# Altium schematic sheet power.SchDoc
size A4
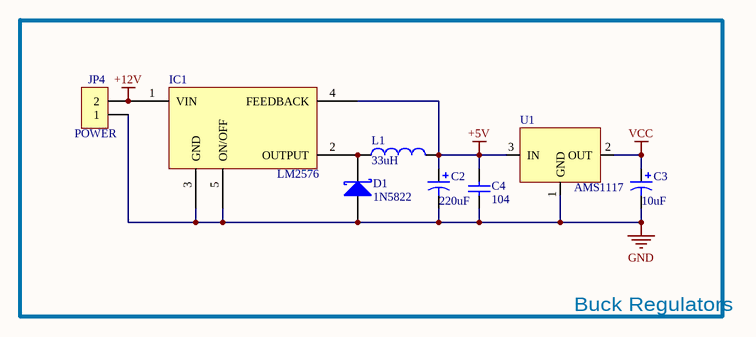
[diagram p0: power.SchDoc]

## Parts
C2  220uF  [CM E(8*10.2)]
C3  10uF  [CD A(3216)]
C4  104  [C 0603_L]
D1  1N5822  [DO_201_AD]
IC1  LM2576  [TO263-5A]
JP4  POWER  [KF128-5.08-2P]
L1  33uH  [CDRH127]
U1  AMS1117  [SOT_223]

## Blocks framed on the sheet
Buck Regulators: C2-C4 D1 IC1 JP4 L1 U1

## Nets
+5V: C2.1 C4.2 IC1.4(FEEDBACK) L1.2 U1.3(IN)
+12V: IC1.1(VIN) JP4.2
GND: C2.2 C3.2 C4.1 D1.1(A) IC1.3(GND) IC1.5(ON/OFF) JP4.1 U1.1(GND)
VCC: C3.1 U1.2(OUT)
NetD1_2: D1.2(K) IC1.2(OUTPUT) L1.1

## Library data of the parts
C2 C3 = Cap Pol1: Polarized Capacitor (Radial); Published: 8-Jun-2000; LatestRevisionDate: 17-Jul-2002; LatestRevisionNote: Re-released for DXP Platform.; PackageReference: RB7.6-15; Publisher: Altium Limited; PackageDescription: Polarized Capacitor (Radial); 2 Leads
  C2: Value: 220uF
  C3: Value: 10uF
C4 = Cap: Capacitor; Published: 8-Jun-2000; LatestRevisionDate: 17-Jul-2002; LatestRevisionNote: Re-released for DXP Platform.; PackageReference: RAD-0.3; Publisher: Altium Limited; PackageDescription: Radial Cap, Thru-Hole; 2 Leads; 0.3 in Pin Spacing; Value: 104
D1 = Diode 11DQ03: Schottky Rectifier; Published: 8-Jun-2000; LatestRevisionDate: 17-Jul-2002; LatestRevisionNote: Re-released for DXP Platform.; DatasheetVersion: Dec-1997; PackageReference: DO-204AL; Publisher: Altium Limited; PackageDescription: Diode, Axial; Body 5.2 x 2.7 mm (LxDia. max), Lead Dia. 0.86 mm (max); Code_JEDEC: DO-204-AL; ComponentLink1Description: Manufacturer Link; ComponentLink1URL: http://www.irf.com/; ComponentLink2Description: Datasheet; ComponentLink2URL: http://www.irf.com/product-info/datasheets/data/11dq03.pdf
IC1 = LM2576: 稳压
JP4 = Header 2: 2P接插件; 版权归属: 源创客; BOM名称: 2P接插件; 学习资源: www.ooocke.com
L1 = Inductor: Code_IEC: 1005; Published: 8-Jun-2000; LatestRevisionDate: 29-May-2009; LatestRevisionNote: IPC-7351 Footprint Added.; PackageReference: 0402-A; Publisher: Altium Limited; PackageDescription: Chip Inductor; Code_JEITA: 0402; Value: 33uH